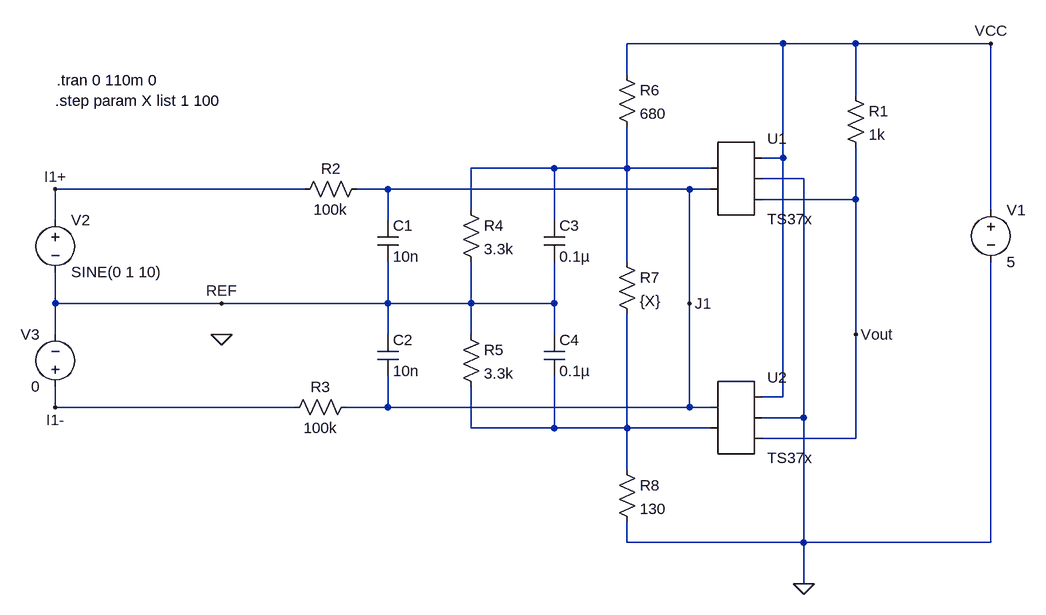
[diagram p0: schematic SCW_disbalance_detector_v.asc]
SCW_disbalance_detector_v.asc, the LTspice schematic file:
Version 4
SHEET 1 880 776
WIRE 192 -96 -48 -96
WIRE 304 -96 192 -96
WIRE 512 -96 304 -96
WIRE -48 -48 -48 -96
WIRE 304 -16 304 -96
WIRE 192 80 192 -96
WIRE 192 80 160 80
WIRE -160 96 -288 96
WIRE -48 96 -48 32
WIRE -48 96 -160 96
WIRE 80 96 -48 96
WIRE 224 112 160 112
WIRE -544 128 -928 128
WIRE -416 128 -464 128
WIRE 48 128 -416 128
WIRE 80 128 48 128
WIRE 304 144 304 64
WIRE 304 144 160 144
WIRE -288 160 -288 96
WIRE 512 160 512 -96
WIRE -928 176 -928 128
WIRE -416 176 -416 128
WIRE -160 176 -160 96
WIRE -48 240 -48 96
WIRE -928 304 -928 256
WIRE -672 304 -928 304
WIRE -416 304 -416 240
WIRE -416 304 -672 304
WIRE -288 304 -288 240
WIRE -288 304 -416 304
WIRE -160 304 -160 240
WIRE -160 304 -288 304
WIRE 48 304 48 128
WIRE -928 352 -928 304
WIRE -416 352 -416 304
WIRE -288 352 -288 304
WIRE -160 352 -160 304
WIRE 304 352 304 144
WIRE 192 448 192 80
WIRE 192 448 160 448
WIRE -928 464 -928 432
WIRE -560 464 -928 464
WIRE -416 464 -416 416
WIRE -416 464 -480 464
WIRE 48 464 48 304
WIRE 48 464 -416 464
WIRE 80 464 48 464
WIRE 224 480 224 112
WIRE 224 480 160 480
WIRE -288 496 -288 432
WIRE -160 496 -160 416
WIRE -160 496 -288 496
WIRE -48 496 -48 320
WIRE -48 496 -160 496
WIRE 80 496 -48 496
WIRE 304 512 304 352
WIRE 304 512 160 512
WIRE -48 560 -48 496
WIRE -48 672 -48 640
WIRE 224 672 224 480
WIRE 224 672 -48 672
WIRE 512 672 512 240
WIRE 512 672 224 672
WIRE 224 736 224 672
FLAG 224 736 0
FLAG 512 -96 VCC
FLAG 304 352 Vout
FLAG -928 128 I1+
FLAG -928 464 I1-
FLAG -672 304 REF
FLAG 48 304 J1
FLAG -672 352 0
SYMBOL AutoGenerated\\TS37x 112 112 R0
SYMATTR InstName U1
SYMBOL AutoGenerated\\TS37x 112 480 R0
SYMATTR InstName U2
SYMBOL voltage 512 144 R0
WINDOW 123 0 0 Left 0
WINDOW 39 0 0 Left 0
SYMATTR InstName V1
SYMATTR Value 5
SYMBOL res 288 -32 R0
SYMATTR InstName R1
SYMATTR Value 1k
SYMBOL res -448 112 R90
WINDOW 0 0 56 VBottom 2
WINDOW 3 32 56 VTop 2
SYMATTR InstName R2
SYMATTR Value 100k
SYMBOL res -464 448 R90
WINDOW 0 0 56 VBottom 2
WINDOW 3 32 56 VTop 2
SYMATTR InstName R3
SYMATTR Value 100k
SYMBOL cap -432 176 R0
SYMATTR InstName C1
SYMATTR Value 10n
SYMBOL cap -432 352 R0
SYMATTR InstName C2
SYMATTR Value 10n
SYMBOL res -304 144 R0
SYMATTR InstName R4
SYMATTR Value 3.3k
SYMBOL cap -176 176 R0
SYMATTR InstName C3
SYMATTR Value 0.1µ
SYMBOL res -304 336 R0
SYMATTR InstName R5
SYMATTR Value 3.3k
SYMBOL cap -176 352 R0
SYMATTR InstName C4
SYMATTR Value 0.1µ
SYMBOL res -64 -64 R0
SYMATTR InstName R6
SYMATTR Value 680
SYMBOL res -64 224 R0
SYMATTR InstName R7
SYMATTR Value {X}
SYMBOL res -64 544 R0
SYMATTR InstName R8
SYMATTR Value 130
SYMBOL voltage -928 160 R0
WINDOW 123 0 0 Left 0
WINDOW 39 0 0 Left 0
SYMATTR InstName V2
SYMATTR Value SINE(0 1 10)
SYMBOL voltage -928 448 R180
WINDOW 0 24 96 Left 2
WINDOW 3 24 16 Left 2
WINDOW 123 0 0 Left 0
WINDOW 39 0 0 Left 0
SYMATTR InstName V3
SYMATTR Value 0
TEXT -926 -40 Left 2 !.tran 0 110m 0
TEXT -928 -8 Left 2 !.step param X list 1 100

The netlist it stands for:
* SCW_disbalance_detector_v.asc
* U1: TS37x (symbol AutoGenerated\TS37x not available, pins judged from their places): pin1=N001 pin2=J1 pin3=VCC pin4=0 pin5=Vout
* U2: TS37x (symbol AutoGenerated\TS37x not available, pins judged from their places): pin1=J1 pin2=N002 pin3=VCC pin4=0 pin5=Vout
V1 VCC 0 5
R1 VCC Vout 1k
R2 J1 I1+ 100k
R3 J1 I1- 100k
C1 J1 REF 10n
C2 REF J1 10n
R4 N001 REF 3.3k
C3 N001 REF 0.1µ
R5 REF N002 3.3k
C4 REF N002 0.1µ
R6 VCC N001 680
R7 N001 N002 {X}
R8 N002 0 130
V2 I1+ REF SINE(0 1 10)
V3 I1- REF 0
.tran 0 110m 0
.step param X list 1 100
.backanno
.end